# Altium project Energyharvesting.PrjPCB
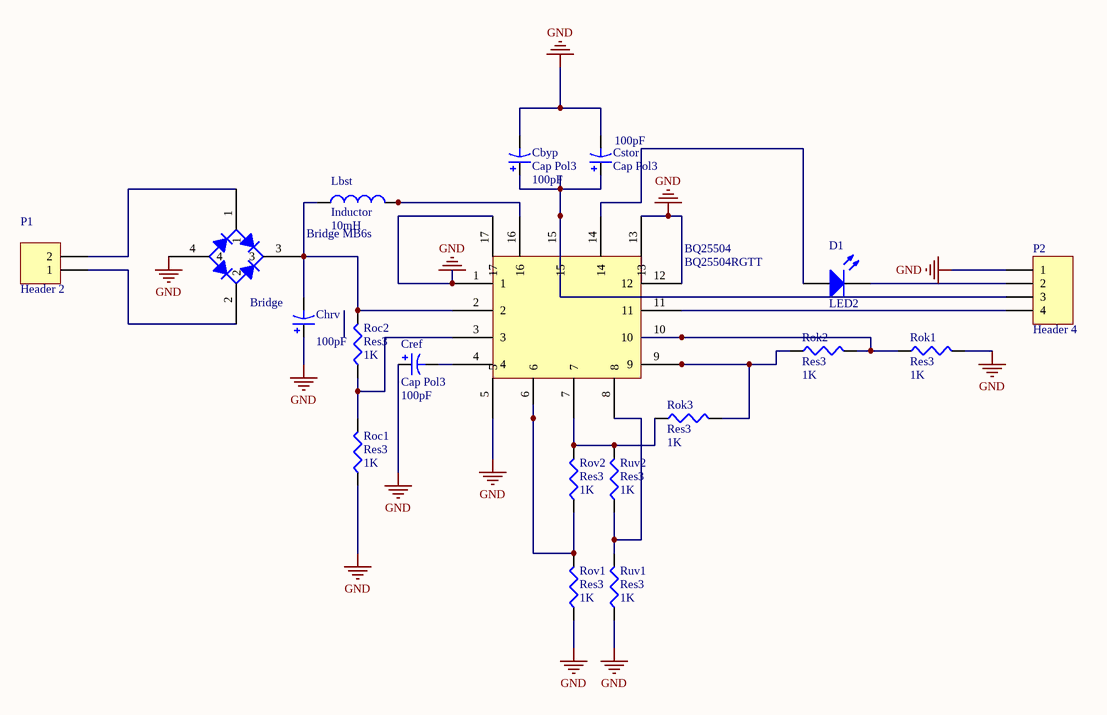
[diagram p0: Energyharvesting.SchDoc]
1 sheet, 19 parts. Net scope: global (net labels, ports and power ports of the same name join across sheets).
Board files: Energyharvesting2.0.PcbDoc, Energyharvesting3.0.PcbDoc

## Sheet Energyharvesting.SchDoc
size A4

### Parts
BQ25504  BQ25504RGTT  [BQ25504rgtt]
Bridge  Bridge MB6s  [MB6S]
Cbyp  Cap Pol3  value 100pF  [C0805]
Chrv  value 100pF  [C0805]  (hidden comment: Cap Pol3)
Cref  Cap Pol3  value 100pF  [C0805]
Cstor  Cap Pol3  value 100pF  [C0805]
D1  LED2  [3.2X1.6X1.1]
Lbst  Inductor  value 10mH  [INDC1608L]
P1  Header 2  [HDR1X2]
P2  Header 4  [HDR1X4]
Roc1  Res3  value 1K  [J1-0603]
Roc2  Res3  value 1K  [J1-0603]
Rok1  Res3  value 1K  [J1-0603]
Rok2  Res3  value 1K  [J1-0603]
Rok3  Res3  value 1K  [J1-0603]
Rov1  Res3  value 1K  [J1-0603]
Rov2  Res3  value 1K  [J1-0603]
Ruv1  Res3  value 1K  [J1-0603]
Ruv2  Res3  value 1K  [J1-0603]

### Nets
GND: BQ25504.1 BQ25504.5 BQ25504.12 BQ25504.13 BQ25504.17 Bridge.4 Cbyp.2 Chrv.1 Cref.1 Cstor.2 P2.1 Roc1.1 Rok1.2 Rov1.1 Ruv1.1
NetBQ25504_2: BQ25504.2 Bridge.3 Chrv.2 Lbst.1 Roc2.2
NetBQ25504_3: BQ25504.3 Roc1.2 Roc2.1
NetBQ25504_4: BQ25504.4 Cref.2
NetBQ25504_6: BQ25504.6 Rov1.2 Rov2.1
NetBQ25504_7: BQ25504.7 Rok3.1 Rov2.2 Ruv2.2
NetBQ25504_8: BQ25504.8 Ruv1.2 Ruv2.1
NetBQ25504_9: BQ25504.9 Rok2.1 Rok3.2
NetBQ25504_10: BQ25504.10 Rok1.1 Rok2.2
NetBQ25504_11: BQ25504.11 P2.4
NetBQ25504_14: BQ25504.14 D1.1(A)
NetBQ25504_15: BQ25504.15 Cbyp.1 Cstor.1 P2.3
NetBQ25504_16: BQ25504.16 Lbst.2
NetBridge_1: Bridge.1 P1.2
NetBridge_2: Bridge.2 P1.1
NetD1_2: D1.2(K) P2.2

### Library data of the parts
Cbyp Chrv Cref Cstor = Cap Pol3: Polarized Capacitor (Surface Mount); Published: 8-Jun-2000; LatestRevisionDate: 29-May-2009; LatestRevisionNote: IPC-7351 Footprint Added.; PackageReference: C0805; Publisher: Altium Limited; PackageDescription: Chip Capacitor
D1 = LED2: Typical RED, GREEN, YELLOW, AMBER GaAs LED; Published: 8-Jun-2000; LatestRevisionDate: 17-Jul-2002; LatestRevisionNote: Re-released for DXP Platform.; PackageVersion: Feb-2002; PackageReference: 3.2X1.6X1.1; Publisher: Altium Limited; PackageDescription: SM LED; 2 Flat Leads
Lbst = Inductor: Code_IEC: 1005; Published: 8-Jun-2000; LatestRevisionDate: 29-May-2009; LatestRevisionNote: IPC-7351 Footprint Added.; PackageReference: 0402-A; Publisher: Altium Limited; PackageDescription: Chip Inductor; Code_JEITA: 0402
P1 = Header 2: Header, 2-Pin; LatestRevisionDate: 17-Jul-2002; LatestRevisionNote: Re-released for DXP Platform.; Publisher: Altium Limited
P2 = Header 4: Header, 4-Pin; LatestRevisionDate: 17-Jul-2002; LatestRevisionNote: Re-released for DXP Platform.; Publisher: Altium Limited
Roc1 Roc2 Rok1-Rok3 Rov1 Rov2 Ruv1 Ruv2 = Res3: Resistor; Published: 8-Jun-2000; LatestRevisionDate: 29-May-2009; LatestRevisionNote: IPC-7351 Footprint Added.; PackageReference: J1-0603; Publisher: Altium Limited; PackageDescription: Chip Resistor